# EAGLE design board_io_v2 (EAGLE 6.3)
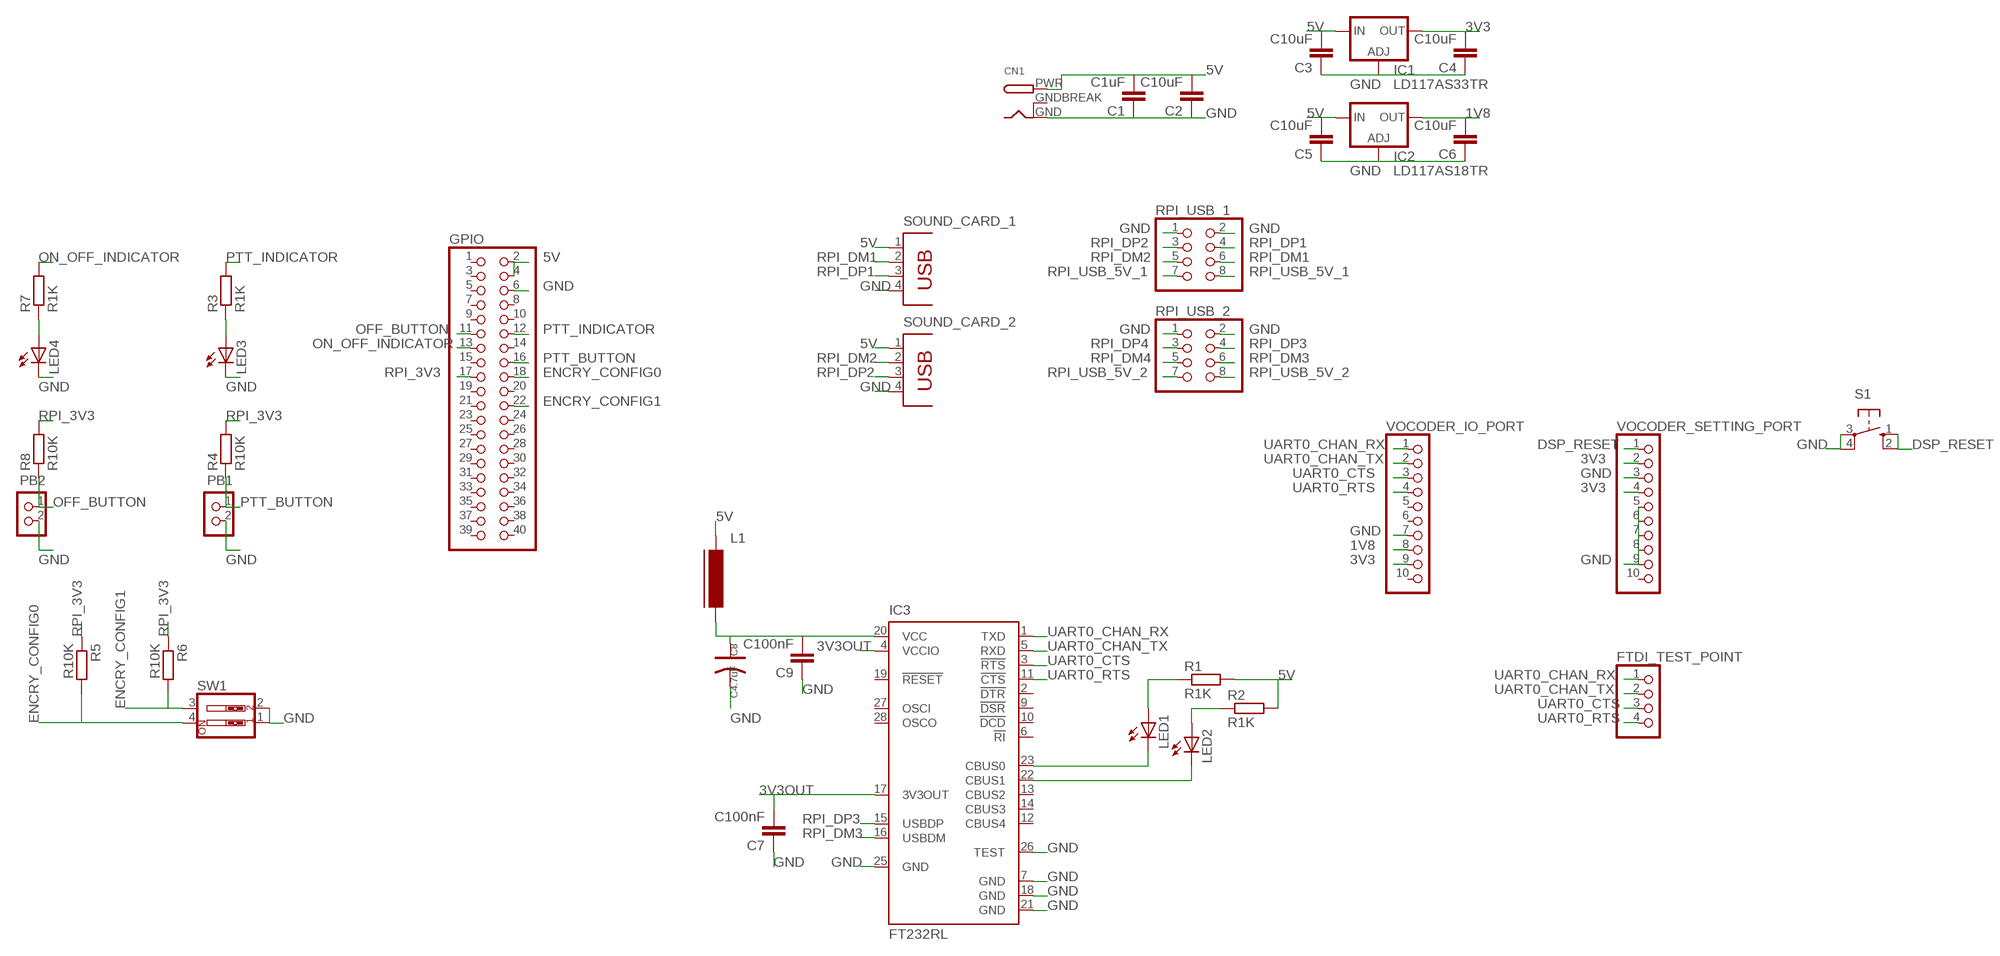
[diagram p0: schematic, sheet 1]

## Parts
C1  C1uF  C-EUC0805  [C0805]
C2  C10uF  C-EUC0805  [C0805]
C3  C10uF  C-EUC0805  [C0805]
C4  C10uF  C-EUC0805  [C0805]
C5  C10uF  C-EUC0805  [C0805]
C6  C10uF  C-EUC0805  [C0805]
C7  C100nF  C-EUC0805  [C0805]
C8  C4.7uF  C-POLAR-C  [AVX-C]
C9  C100nF  C-EUC0805  [C0805]
CN1  DCBARRELPTH  [DCJACK_2MM_PTH]
FTDI_TEST_POINT  PINHD-1X4  [1X04]
GPIO  PINHD-2X20  [2X20]
IC1  LD117AS33TR  [SOT223]
IC2  LD117AS18TR  [SOT223]
IC3  FT232RL  [SSOP28]
L1  FERRITE-0603  [FB603]
LED1  LEDCHIP-LED0805  [CHIP-LED0805]
LED2  LEDCHIP-LED0805  [CHIP-LED0805]
LED3  LEDCHIP-LED0805  [CHIP-LED0805]
LED4  LEDCHIP-LED0805  [CHIP-LED0805]
PB1  CON_HEADER_1X02-PTH  [M1X2]
PB2  CON_HEADER_1X02-PTH  [M1X2]
R1  R1K  R-EU_R0805  [R0805]
R2  R1K  R-EU_R0805  [R0805]
R3  R1K  R-EU_R0805  [R0805]
R4  R10K  R-EU_R0805  [R0805]
R5  R10K  R-EU_R0805  [R0805]
R6  R10K  R-EU_R0805  [R0805]
R7  R1K  R-EU_R0805  [R0805]
R8  R10K  R-EU_R0805  [R0805]
RPI_USB_1  PINHD-2X4  [2X04]
RPI_USB_2  PINHD-2X4  [2X04]
S1  10-XX  [B3F-10XX]
SOUND_CARD_1  PN87520  [PN87520]
SOUND_CARD_2  PN87520  [PN87520]
SW1  SW_DIP-2  [DIPSWITCH-02]
VOCODER_IO_PORT  PINHD-1X10  [1X10]
VOCODER_SETTING_PORT  PINHD-1X10  [1X10]

## Nets
1V8: C6.2 IC2.4(OUT) VOCODER_IO_PORT.8
3V3: C4.2 IC1.4(OUT) VOCODER_IO_PORT.9 VOCODER_SETTING_PORT.2 VOCODER_SETTING_PORT.4
3V3OUT: C7.2 IC3.4(VCCIO) IC3.17(3V3OUT)
5V: C1.2 C2.2 C3.2 C5.2 CN1.PWR GPIO.2 GPIO.4 IC1.3(IN) IC2.3(IN) L1.1 R1.2 R2.2 SOUND_CARD_1.1 SOUND_CARD_2.1
DSP_RESET: S1.1(S) S1.2(S1) VOCODER_SETTING_PORT.1
ENCRY_CONFIG0: GPIO.18 R5.2 SW1.4
ENCRY_CONFIG1: GPIO.22 R6.2 SW1.3
GND: C1.1 C2.1 C3.1 C4.1 C5.1 C6.1 C7.1 C8.- C9.1 CN1.GND GPIO.6 IC1.1(ADJ) IC2.1(ADJ) IC3.7(GND) IC3.18(GND) IC3.21(GND) IC3.25(GND) IC3.26(TEST) LED3.C LED4.C PB1.2 PB2.2 RPI_USB_1.1 RPI_USB_1.2 RPI_USB_2.1 RPI_USB_2.2 S1.3(P) S1.4(P1) SOUND_CARD_1.4 SOUND_CARD_2.4 SW1.1 SW1.2 VOCODER_IO_PORT.7 VOCODER_SETTING_PORT.3 VOCODER_SETTING_PORT.5 VOCODER_SETTING_PORT.6 VOCODER_SETTING_PORT.7 VOCODER_SETTING_PORT.8 VOCODER_SETTING_PORT.9
N$1: C8.+ C9.2 IC3.20(VCC) L1.2
N$2: IC3.22(CBUS1) LED2.C
N$3: IC3.23(CBUS0) LED1.C
N$4: LED2.A R2.1
N$5: LED1.A R1.1
N$6: LED4.A R7.1
N$7: LED3.A R3.1
OFF_BUTTON: GPIO.11 PB2.1 R8.1
ON_OFF_INDICATOR: GPIO.13 R7.2
PTT_BUTTON: GPIO.16 PB1.1 R4.1
PTT_INDICATOR: GPIO.12 R3.2
RPI_3V3: GPIO.17 R4.2 R5.1 R6.1 R8.2
RPI_DM1: RPI_USB_1.6 SOUND_CARD_1.2
RPI_DM2: RPI_USB_1.5 SOUND_CARD_2.2
RPI_DM3: IC3.16(USBDM) RPI_USB_2.6
RPI_DM4: RPI_USB_2.5
RPI_DP1: RPI_USB_1.4 SOUND_CARD_1.3
RPI_DP2: RPI_USB_1.3 SOUND_CARD_2.3
RPI_DP3: IC3.15(USBDP) RPI_USB_2.4
RPI_DP4: RPI_USB_2.3
RPI_USB_5V_1: RPI_USB_1.7 RPI_USB_1.8
RPI_USB_5V_2: RPI_USB_2.7 RPI_USB_2.8
UART0_CHAN_RX: FTDI_TEST_POINT.1 IC3.1(TXD) VOCODER_IO_PORT.1
UART0_CHAN_TX: FTDI_TEST_POINT.2 IC3.5(RXD) VOCODER_IO_PORT.2
UART0_CTS: FTDI_TEST_POINT.3 IC3.3(!RTS) VOCODER_IO_PORT.3
UART0_RTS: FTDI_TEST_POINT.4 IC3.11(!CTS) VOCODER_IO_PORT.4
Unconnected: GPIO.1 GPIO.3 GPIO.5 GPIO.7 GPIO.8 GPIO.9 GPIO.10 GPIO.14 GPIO.15 GPIO.19 GPIO.20 GPIO.21 GPIO.23 GPIO.24 GPIO.25 GPIO.26 GPIO.27 GPIO.28 GPIO.29 GPIO.30 GPIO.31 GPIO.32 GPIO.33 GPIO.34 GPIO.35 GPIO.36 GPIO.37 GPIO.38 GPIO.39 GPIO.40 IC3.2(!DTR) IC3.6(!RI) IC3.9(!DSR) IC3.10(!DCD) IC3.12(CBUS4) IC3.13(CBUS2) IC3.14(CBUS3) IC3.19(!RESET) IC3.27(OSCI) IC3.28(OSCO) VOCODER_IO_PORT.5 VOCODER_IO_PORT.6 VOCODER_IO_PORT.10 VOCODER_SETTING_PORT.10

## Power pins joined to a net without a drawn wire
GNDBREAK: CN1.GNDBREAK

## Library data of the parts
C1-C7 C9 = resistor:C-EU: CAPACITOR, European symbol
C8 = OPL Eagle Library:C-POLAR*
CN1 = adafruit:DCBARREL: 2.0mm DC Barrel Jack DCJACK_2MM_PTH - Through Hole Jack (4UConnector: 05537)
FTDI_TEST_POINT = pinhead:PINHD-1X4: PIN HEADER
GPIO = pinhead:PINHD-2X20: PIN HEADER
IC1 IC2 = v-reg:LD117A?*: Low drop fixed and adjustable positive voltage regulators 1 A Source: http://www.st.com/stonline/products/literature/ds/7194/ld1117axx.pdf
IC3 = ftdichip:FT232R: Source: http://www.ftdichip.com/Documents/DataSheets/DS_FT232R_v104.pdf; MPN: FT232RL; OC_FARNELL: 1146032; OC_NEWARK: 91K9918
L1 = dp_devices:FERRITE: Ferrite bead in various packages
LED1-LED4 = led:LED: LED OSRAM: - CHIPLED LG R971, LG N971, LY N971, LG Q971, LY Q971, LO R971, LY R971 LH N974, LH R974 LS Q976, LO Q976, LY Q976 LO Q996 - Hyper CHIPLED LW Q18S LB Q993, LB Q99A, LB R99A - SideLED LS A670, LO A670, LY A670, LG A670, LP A670 LB A673, LV A673, LT A673, LW A673 LH A674 LY A675 LS A676, LA A676, LO A676, LY A676, LW A676 LS A679, LY A679, LG A679 - Hyper Micro SIDELED® LS Y876, LA Y876, LO Y876, LY Y876 LT Y87S - SmartLED LW L88C, LW L88S LB L89C, LB L89S, LG L890 LS L89K, LO L89K, LY L89K LS L896, LA L896, LO L896, LY L896 - TOPLED LS T670, LO T670, LY T670, LG T670, LP T670 LSG T670, LSP T670, LSY T670, LOP T670, LYG T670 LG T671, LOG T671, LSG T671 LB T673, LV T673, LT T673, LW T673 LH T674 LS T676, LA T676, LO T676, LY T676, LB T676, LH T676, LSB T676, LW T676 LB T67C, LV T67C, LT T67C, LS T67K, LO T67K, LY T67K, LW E67C LS E67B, LA E67B, LO E67B, LY E67B, LB E67C, LV E67C, LT E67C LW T67C LS T679, LY T679, LG T679 LS T770, LO T770, LY T770, LG T770, LP T770 LB T773, LV T773, LT T773, LW T773 LH T774 LS E675, LA E675, LY E675, LS T675 LS T776, LA T776, LO T776, LY T776, LB T776 LHGB T686 LT T68C, LB T68C - Hyper Mini TOPLED® LB M676 - Mini TOPLED Santana® LG M470 LS M47K, LO M47K, LY M47K Source: http://www.osram.convergy.de LUXEON: - LUMILED® LXK2-PW12-R00, LXK2-PW12-S00, LXK2-PW14-U00, LXK2-PW14-V00 LXK2-PM12-R00, LXK2-PM12-S00, LXK2-PM14-U00 LXK2-PE12-Q00, LXK2-PE12-R00, LXK2-PE12-S00, LXK2-PE14-T00, LXK2-PE14-U00 LXK2-PB12-K00, LXK2-PB12-L00, LXK2-PB12-M00, LXK2-PB14-N00, LXK2-PB14-P00, LXK2-PB14-Q00 LXK2-PR12-L00, LXK2-PR12-M00, LXK2-PR14-Q00, LXK2-PR14-R00 LXK2-PD12-Q00, LXK2-PD12-R00, LXK2-PD12-S00 LXK2-PH12-R00, LXK2-PH12-S00 LXK2-PL12-P00, LXK2-PL12-Q00, LXK2-PL12-R00 Source: www.luxeon.com KINGBRIGHT: KA-3528ASYC Source: www.kingbright.com
PB1 PB2 = dp_devices:CON_HEADER_1X02
R1-R8 = resistor:R-EU_: RESISTOR, European symbol
RPI_USB_1 RPI_USB_2 = pinhead:PINHD-2X4: PIN HEADER
S1 = switch-omron:10-XX: OMRON SWITCH; MPN: B3F-1000; OC_FARNELL: 176432; OC_NEWARK: 36M3542
SOUND_CARD_1 SOUND_CARD_2 = con-berg:PN87520: BERG USB connector; OC_FARNELL: unknown; OC_NEWARK: unknown
SW1 = SparkFun-Electromechanical:SW_DIP-2: DIP SWITCH
VOCODER_IO_PORT VOCODER_SETTING_PORT = pinhead:PINHD-1X10: PIN HEADER

## Board
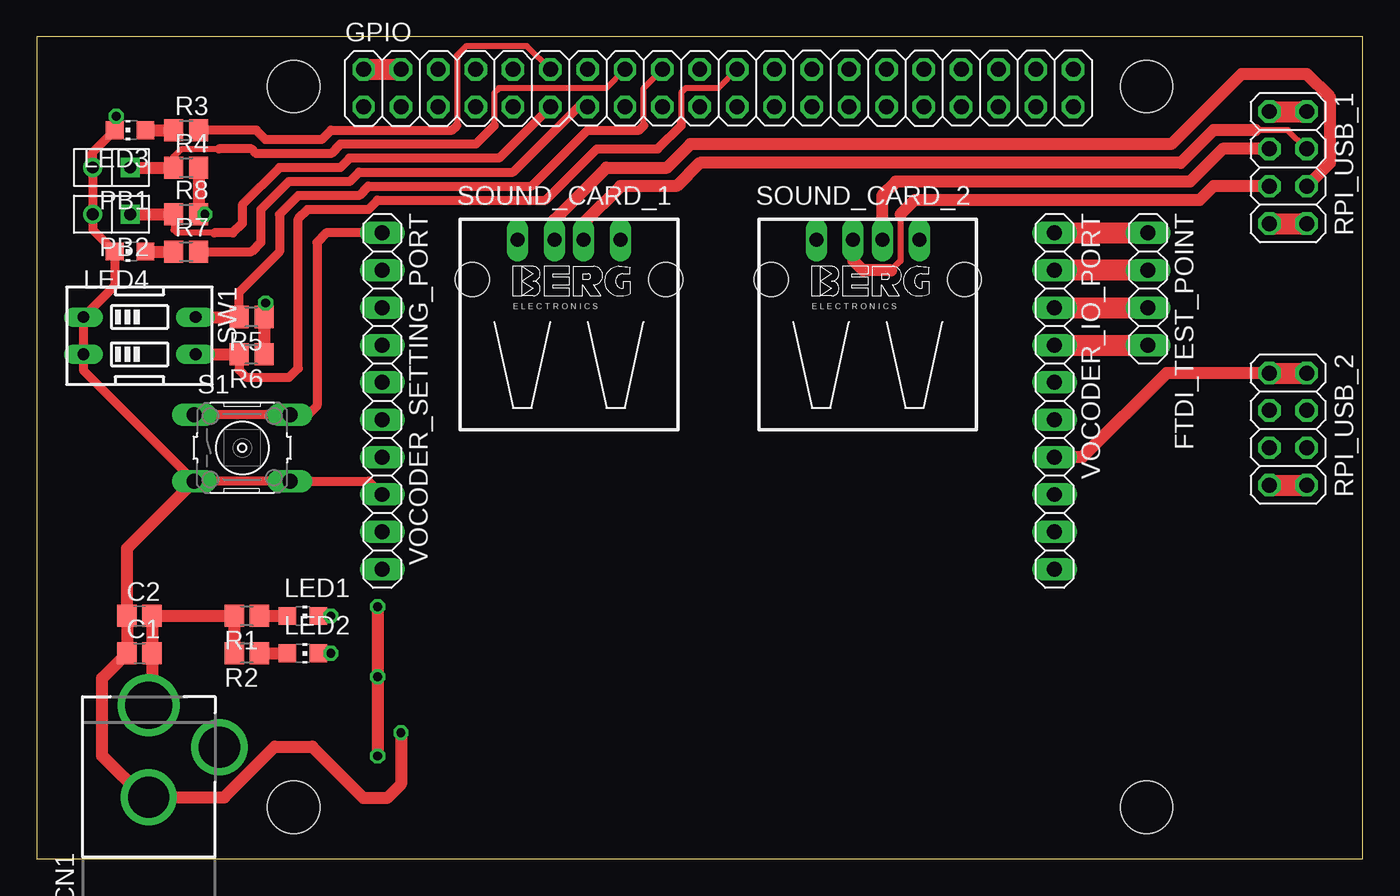
[diagram p1: board, top side]
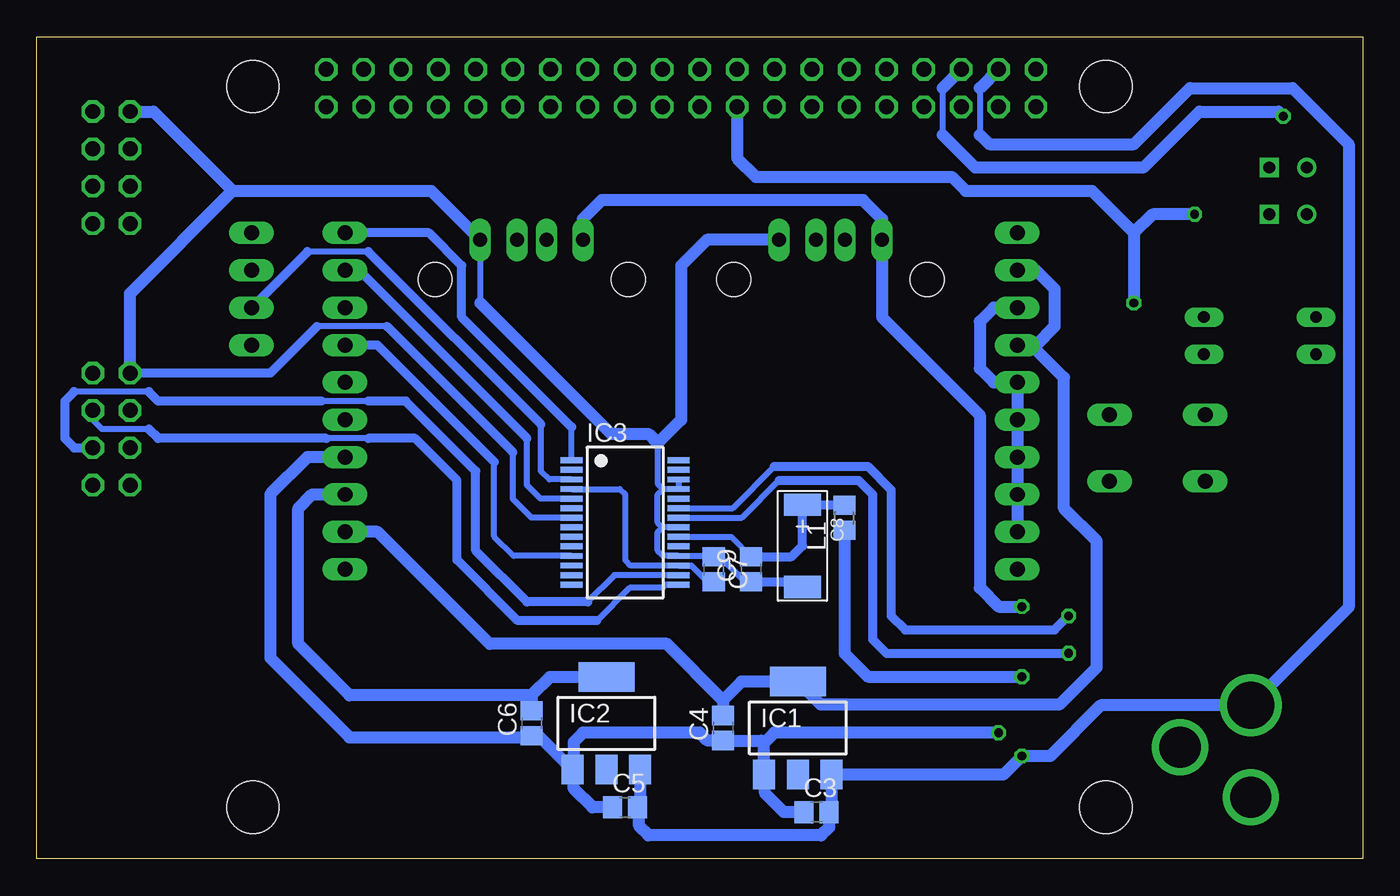
[diagram p2: board, bottom side, seen from below]

Size 90.17 x 55.88 mm. Coordinates in mm from the lower left corner, seen from the top.
Outline: 0,0 90.17,0 90.17,55.88 0,55.88 0,0
Copper layers (1*16): Top 0.035mm / dielectric 1.5mm / Bottom 0.035mm
Design rules "default": minimum track width 10mil, minimum drill 24mil, track to track 8mil, track to pad 8mil, pad to pad 8mil, via to via 8mil, smd to smd 8mil, copper to edge 40mil, drill to drill 8mil, minimum pad ring 10mil, minimum via ring 8mil, stop-mask expansion 4mil, vias tented up to drill 0mil, thermal gap 10mil
Holes 3.55 mm at 17.47,3.5 75.47,3.5 17.47,52.5 75.47,52.5
tRestrict: area 15.9,1.9 to 19,5; area 73.9,1.9 to 77,5; area 15.9,51 to 19,54; area 73.9,51 to 77,54
bRestrict: area 15.9,1.9 to 19,5; area 73.9,1.9 to 77,5; area 73.9,51 to 77,54; area 15.9,51 to 19,54

### Footprints (pad centres in the part's own frame; a part is rotated, then mirrored left to right if it is on the bottom)
C0805 = smd 1.3 x 1.5: 1 -0.85,0; 2 0.85,0
AVX-C = smd 1.524 x 2.54: + -2.794,0; - 2.794,0
DCJACK_2MM_PTH = drill 2.8: GND 0,7.35; GNDBREAK 4.8,10.75 | drill 3.2: PWR 0,13.6
1X04 = drill 1.016 long: 1 -3.81,0; 2 -1.27,0; 3 1.27,0; 4 3.81,0
2X20 = drill 1.016 octagon: 1 -24.13,-1.27; 2 -24.13,1.27; 3 -21.59,-1.27; 4 -21.59,1.27; 5 -19.05,-1.27; 6 -19.05,1.27; 7 -16.51,-1.27; 8 -16.51,1.27; 9 -13.97,-1.27; 10 -13.97,1.27; 11 -11.43,-1.27; 12 -11.43,1.27; 13 -8.89,-1.27; 14 -8.89,1.27; 15 -6.35,-1.27; 16 -6.35,1.27; 17 -3.81,-1.27; 18 -3.81,1.27; 19 -1.27,-1.27; 20 -1.27,1.27; 21 1.27,-1.27; 22 1.27,1.27; 23 3.81,-1.27; 24 3.81,1.27; 25 6.35,-1.27; 26 6.35,1.27; 27 8.89,-1.27; 28 8.89,1.27; 29 11.43,-1.27; 30 11.43,1.27; 31 13.97,-1.27; 32 13.97,1.27; 33 16.51,-1.27; 34 16.51,1.27; 35 19.05,-1.27; 36 19.05,1.27; 37 21.59,-1.27; 38 21.59,1.27; 39 24.13,-1.27; 40 24.13,1.27
SOT223 = smd 1.5 x 2: 1 -2.3,-3.15; 2 0,-3.15; 3 2.3,-3.15 | smd 3.8 x 2: 4 0,3.15
SSOP28 = smd 0.4 x 1.5: 1 -4.225,-3.625; 2 -3.575,-3.625; 3 -2.925,-3.625; 4 -2.275,-3.625; 5 -1.625,-3.625; 6 -0.975,-3.625; 7 -0.325,-3.625; 8 0.325,-3.625; 9 0.975,-3.625; 10 1.625,-3.625; 11 2.275,-3.625; 12 2.925,-3.625; 13 3.575,-3.625; 14 4.225,-3.625; 15 4.225,3.625; 16 3.575,3.625; 17 2.925,3.625; 18 2.275,3.625; 19 1.625,3.625; 20 0.975,3.625; 21 0.325,3.625; 22 -0.325,3.625; 23 -0.975,3.625; 24 -1.625,3.625; 25 -2.275,3.625; 26 -2.925,3.625; 27 -3.575,3.625; 28 -4.225,3.625
FB603 = smd 1.3 x 1.5: 1 -0.85,0; 2 0.85,0
CHIP-LED0805 = smd 1.2 x 1.2: A 0,-1.05; C 0,1.05
M1X2 = drill 0.8 square: 1 -1.27,0 | drill 0.8: 2 1.27,0
R0805 = smd 1.3 x 1.5: 1 -0.85,0; 2 0.85,0
2X04 = drill 1.016 octagon: 1 -3.81,-1.27; 2 -3.81,1.27; 3 -1.27,-1.27; 4 -1.27,1.27; 5 1.27,-1.27; 6 1.27,1.27; 7 3.81,-1.27; 8 3.81,1.27
B3F-10XX = drill 1.016 long: 1 -3.251,2.261; 2 3.251,2.261; 3 -3.251,-2.261; 4 3.251,-2.261
PN87520 = drill 0.95 long: 1 -3.5,2.71; 2 -1,2.71; 3 1,2.71; 4 3.5,2.71 | hole 2.3: -6.57,0; 6.57,0
DIPSWITCH-02 = drill 0.813 long: 1 -1.27,-3.81; 2 1.27,-3.81; 3 1.27,3.81; 4 -1.27,3.81
1X10 = drill 1.016 long: 1 -11.43,0; 2 -8.89,0; 3 -6.35,0; 4 -3.81,0; 5 -1.27,0; 6 1.27,0; 7 3.81,0; 8 6.35,0; 9 8.89,0; 10 11.43,0

### Placement (x,y rotation side)
C1  6.99,13.97 0 top
C2  6.99,16.51 0 top
C3  37.15,3.17 0 bottom
C4  43.5,8.89 90 bottom
C5  50.16,3.49 0 bottom
C6  56.52,9.21 90 bottom
C7  44.13,19.68 270 bottom
C8  38.1,21.27 270 bottom
C9  41.59,19.68 90 bottom
CN1  7.62,-3.17 0 top
FTDI_TEST_POINT  75.56,38.73 270 top
GPIO  46.35,52.39 0 top
IC1  38.42,8.89 0 bottom
IC2  51.44,9.21 0 bottom
IC3  50.16,22.86 270 bottom
L1  35.24,23.18 90 bottom
LED1  18.1,16.51 270 top
LED2  18.1,13.97 270 top
LED3  6.35,49.53 90 top
LED4  6.35,41.27 90 top
PB1  5.08,46.99 180 top
PB2  5.08,43.81 180 top
R1  14.29,16.51 180 top
R2  14.29,13.97 180 top
R3  10.16,49.53 0 top
R4  10.16,46.99 0 top
R5  14.61,36.83 180 top
R6  14.61,34.29 180 top
R7  10.16,41.27 0 top
R8  10.16,43.81 0 top
RPI_USB_1  85.09,46.99 270 top
RPI_USB_2  85.09,29.21 270 top
S1  13.97,27.94 0 top
SOUND_CARD_1  36.2,39.37 0 top
SOUND_CARD_2  56.52,39.37 0 top
SW1  6.99,35.56 270 top
VOCODER_IO_PORT  69.22,31.11 270 top
VOCODER_SETTING_PORT  23.5,31.11 270 top

### Tracks (layer width: path | path; a pad name or v marks a point on that pad's centre or on a via)
1V8
  Bottom 0.813: IC2.4 55.27,12.36 56.52,11.11 | 56.52,11.11 C6.2 | 56.52,11.11 68.9,11.11 72.39,14.61 72.39,23.81 71.44,24.77 VOCODER_IO_PORT.8
3V3
  Bottom 0.813: 43.5,10.79 42.25,12.04 IC1.4 36.86,10.48 20.64,10.48 18.1,13.02 18.1,21.59 20.32,23.81 20.32,32.7 22.54,34.92 | 43.5,10.79 C4.2 | 43.5,10.79 47.31,14.61 59.37,14.61 66.99,22.23 VOCODER_IO_PORT.9 | VOCODER_SETTING_PORT.2 22.23,40.01 20.96,38.73 20.96,36.2 22.23,34.92 22.54,34.92 | 22.54,34.92 VOCODER_SETTING_PORT.4
3V3OUT
  Bottom 0.406: C7.2 44.35,19.05 44.77,19.05 45.65,19.93 IC3.17 49.78,19.93 50.16,20.32 50.16,24.77 50.53,25.14 IC3.4
5V  (via drill 0.6)
  Top 0.813: R2.2 R1.2 C2.2 C1.2 7.84,10.64 CN1.PWR | v23.18,17.14 v23.18,12.38 v23.18,6.99
  Top 1.422: GPIO.2 GPIO.4
  Bottom 0.406: 26.04,52.39 26.04,49.21
  Bottom 0.813: IC2.3 49.13,3.67 C5.2 49.21,3.39 49.21,2.22 48.58,1.59 36.83,1.59 36.3,2.12 C3.2 36.12,3.35 IC1.3 25.69,5.74 25.67,5.71 24.45,5.71 v23.18,6.99 21.27,6.99 17.83,10.43 CN1.PWR 0.95,17.09 0.95,48.58 4.76,52.39 11.75,52.39 15.56,48.58 25.4,48.58 26.04,49.21 | SOUND_CARD_2.1 53.02,43.5 51.75,44.77 33.97,44.77 32.7,43.49 SOUND_CARD_1.1 32.7,36.82 26.04,30.16 26.04,18.41 24.77,17.14 v23.18,17.14 | GPIO.4 26.04,52.39 | L1.1 35.24,13.97 33.66,12.38 v23.18,12.38
DSP_RESET
  Top 0.61: VOCODER_SETTING_PORT.1 19.69,42.55 19.05,41.91 19.05,30.8 18.41,30.16 17.26,30.16 S1.2 S1.1
ENCRY_CONFIG0
  Top 0.406: GPIO.18 41.27,52.39 41.27,49.85
  Top 0.61: 41.27,49.85 40.96,49.53 37.47,49.53 33.66,45.72 22.54,45.72 21.91,45.09 17.78,45.09 16.51,43.81 16.51,41.27 13.76,38.52 R5.2 13.97,37.05
  Top 0.813: SW1.4 R5.2
ENCRY_CONFIG1
  Top 0.406: GPIO.22 46.35,52.39 44.13,52.39 43.81,52.07 43.81,50.16 | 13.65,34.39 R6.2
  Top 0.61: 43.81,50.16 43.81,49.85 42.23,48.26 38.1,48.26 34.61,44.77 23.18,44.77 22.54,44.13 18.41,44.13 17.78,43.5 17.78,33.34 17.14,32.7 14.29,32.7 13.76,33.23 R6.2
  Top 0.813: SW1.3 R6.2
GND  (via drill 0.6)
  Top 0.61: LED3.C 3.81,48.04 PB1.2 PB2.2 3.81,42.77 LED4.C 5.3,38.95 SW1.1 SW1.2 3.18,33.22 S1.3 S1.4 22.58,25.68 VOCODER_SETTING_PORT.8
  Top 0.813: RPI_USB_2.1 76.84,33.02 71.12,27.3 VOCODER_IO_PORT.7 | v5.4,50.48 5.4,49.63 LED3.C | S1.3 6.14,21.1 C2.1 C1.1 4.45,12.28 4.45,6.99 7.26,4.17 CN1.GND 12.75,4.17 16.19,7.62 18.73,7.62 22.23,4.13 23.81,4.13 24.77,5.08 v24.77,8.57
  Top 1.422: RPI_USB_1.1 RPI_USB_1.2 | RPI_USB_2.1 RPI_USB_2.2
  Bottom 0.406: IC3.7 56.52,23.18 57.78,24.45 57.78,27.62 | IC3.26 IC3.25 47.57,25.14 | 47.57,25.14 47.94,24.77 47.94,22.86 47.62,22.54 | IC3.21 47.62,22.54 | 47.62,22.54 47.94,22.21 47.94,20.95 47.57,20.59 IC3.18 44.18,20.59 C7.1 43.71,20.54 42.23,19.05 41.81,19.05 C9.1 | 66.36,36.2 71.12,36.2 | SOUND_CARD_2.4 60.02,37.79 60.01,37.78 | 47.94,28.26 47.94,25.5 47.57,25.14 | 28.58,52.39 28.58,49.21
  Bottom 0.61: 57.78,27.62 66.36,36.2 | C9.1 38.46,18.84 C8.- | 71.12,36.2 74.3,33.02 RPI_USB_2.1
  Bottom 0.813: C5.1 52.39,3.49 53.66,4.76 53.66,5.98 IC2.1 | IC2.1 56.03,8.36 C6.1 56.62,8.26 68.9,8.26 74.3,13.65 74.3,24.77 71.75,27.3 VOCODER_IO_PORT.7 | C3.1 39.37,3.17 40.64,4.45 40.64,5.66 IC1.1 40.72,7.86 | IC2.1 53.66,6.13 53.66,7.94 53.02,8.57 45.09,8.57 44.55,8.04 C4.1 40.9,8.04 40.72,7.86 | VOCODER_SETTING_PORT.9 VOCODER_SETTING_PORT.8 VOCODER_SETTING_PORT.7 VOCODER_SETTING_PORT.6 VOCODER_SETTING_PORT.5 25.08,32.38 26.04,33.34 26.04,36.51 25.08,37.47 VOCODER_SETTING_PORT.3 | 60.01,37.78 51.12,28.89 48.58,28.89 47.94,28.26 46.35,29.84 46.35,40.32 44.6,42.08 SOUND_CARD_1.4 | SOUND_CARD_2.4 63.34,45.4 76.84,45.4 | RPI_USB_1.1 82.23,50.8 76.84,45.4 | RPI_USB_2.1 83.82,38.42 76.84,45.4 | GPIO.6 28.58,52.39 | 28.58,49.21 26.35,46.99 14.92,46.99 11.11,50.8 5.71,50.8 v5.4,50.48 | 40.72,7.86 40.01,8.57 v24.77,8.57
N$1
  Bottom 0.406: IC3.20 42.94,21.89 C9.2
  Bottom 0.61: C9.2 38.84,20.54 38.1,21.27 C8.+ 35.28,24.07 L1.2
N$2  (via drill 0.6)
  Top 0.61: v20,13.97 LED2.C
  Bottom 0.406: IC3.22 42.22,23.18 39.69,25.72
  Bottom 0.61: 39.69,25.72 34.29,25.72 33.34,24.77 33.34,14.92 32.38,13.97 v20,13.97
N$3  (via drill 0.6)
  Top 0.61: v20,16.51 LED1.C
  Bottom 0.406: IC3.23 42.84,23.84 40.01,26.67
  Bottom 0.61: 40.01,26.67 33.66,26.67 32.07,25.08 32.07,16.51 31.12,15.56 20.96,15.56 v20,16.51
N$4
  Top 0.813: R2.1 LED2.A
N$5
  Top 0.813: R1.1 LED1.A
N$6
  Top 0.813: LED4.A R7.1
N$7
  Top 0.813: LED3.A R3.1
OFF_BUTTON
  Top 0.406: 12.07,42.55 9.53,42.55 9.31,42.76 R8.1
  Top 0.61: GPIO.11 31.43,47.62 21.27,47.62 20.64,46.99 16.51,46.99 13.97,44.45 13.97,43.18 13.34,42.55 12.07,42.55
  Top 0.813: PB2.1 R8.1
ON_OFF_INDICATOR
  Top 0.61: GPIO.13 36.83,51.12 32.38,46.67 21.91,46.67 21.27,46.04 17.14,46.04 15.24,44.13 15.24,41.91 14.61,41.27 R7.2
PTT_BUTTON
  Top 0.406: GPIO.16 38.73,52.39 31.43,52.39 31.12,52.07 31.12,49.85 | R4.1 9.31,47.73 9.84,48.26 12.38,48.26
  Top 0.61: 31.12,49.85 29.84,48.58 20.64,48.58 20,47.94 14.92,47.94 14.61,48.26 12.38,48.26
  Top 0.813: PB1.1 R4.1
PTT_INDICATOR
  Top 0.406: GPIO.12 33.34,55.24 29.21,55.24 28.58,54.61 28.58,49.85
  Top 0.61: 28.58,49.85 28.26,49.53 20,49.53 19.37,48.9 15.56,48.9 14.92,49.53 R3.2
RPI_3V3  (via drill 0.6)
  Top 0.813: R4.2 R8.2 v11.43,43.81 | R6.1 R5.1 15.56,36.93 v15.56,37.78
  Bottom 0.813: v11.43,43.81 14.29,43.81 15.56,42.55 | 15.56,42.55 v15.56,37.78 | GPIO.17 42.55,47.62 41.27,46.35 27.94,46.35 26.99,45.4 18.41,45.4 15.56,42.55
RPI_DM1
  Top 0.813: RPI_USB_1.6 87.95,47.31 87.95,51.75 86.36,53.34 81.91,53.34 77.15,48.58 44.45,48.58 42.86,46.99 38.73,46.99 35.2,43.45 SOUND_CARD_1.2
RPI_DM2
  Top 0.406: 58.74,43.81 58.74,40.64 58.1,40.01
  Top 0.813: RPI_USB_1.5 80.01,45.72 79.06,44.77 59.69,44.77 58.74,43.81 | 58.1,40.01 56.2,40.01 55.52,40.69 SOUND_CARD_2.2
RPI_DM3
  Bottom 0.406: IC3.16 50.88,19.29 52.7,17.46 | 67.63,31.11 70.8,31.11 | 82.55,31.75 87.63,31.75
  Bottom 0.61: 52.7,17.46 56.83,17.46 60.32,20.95 60.32,26.35 65.09,31.11 67.63,31.11 | 82.55,31.75 81.91,31.11 70.8,31.11 | 87.63,31.75 88.27,31.11 88.27,28.57 87.63,27.94 RPI_USB_2.6
RPI_DP1
  Top 0.406: RPI_USB_1.4 85.09,49.53 82.87,49.53
  Top 0.813: 82.87,49.53 80.01,49.53 77.79,47.31 45.09,47.31 43.5,45.72 39.69,45.72 37.2,43.23 SOUND_CARD_1.3
RPI_DP2
  Top 0.813: RPI_USB_1.3 80.64,48.26 78.42,46.04 58.42,46.04 57.52,45.13 SOUND_CARD_2.3
RPI_DP3
  Bottom 0.406: IC3.15 47.41,18.64 47.62,18.41 49.85,18.41 52.07,16.19 | 67.63,28.57 70.48,28.57 | 82.55,29.21 85.72,29.21 86.36,29.84 RPI_USB_2.4
  Bottom 0.61: 52.07,16.19 57.47,16.19 61.59,20.32 61.59,25.72 64.45,28.57 67.63,28.57 | 70.48,28.57 81.91,28.57 82.55,29.21
RPI_USB_5V_1
  Top 1.422: RPI_USB_1.7 RPI_USB_1.8
RPI_USB_5V_2
  Top 1.422: RPI_USB_2.7 RPI_USB_2.8
UART0_CHAN_RX
  Top 1.422: VOCODER_IO_PORT.1 FTDI_TEST_POINT.1
  Bottom 0.406: IC3.1 53.79,29.34
  Bottom 0.61: 53.79,29.34 61.28,36.83 61.28,40.32 63.5,42.55 VOCODER_IO_PORT.1
UART0_CHAN_TX
  Top 1.422: FTDI_TEST_POINT.2 VOCODER_IO_PORT.2
  Bottom 0.406: IC3.5 55.92,24.48 56.83,25.4 56.83,28.57
  Bottom 0.61: 56.83,28.57 68.26,40.01 VOCODER_IO_PORT.2
UART0_CTS
  Top 1.422: VOCODER_IO_PORT.3 FTDI_TEST_POINT.3
  Bottom 0.406: 67.63,41.27 71.75,41.27 | 55.88,29.53 55.88,26.35 55.31,25.79 IC3.3
  Bottom 0.61: 71.75,41.27 FTDI_TEST_POINT.3 | 55.88,29.53 67.63,41.27
UART0_RTS
  Top 1.422: VOCODER_IO_PORT.4 FTDI_TEST_POINT.4
  Bottom 0.406: IC3.11 57.73,20.59 59.05,21.91 59.05,26.99
  Bottom 0.61: VOCODER_IO_PORT.4 66.99,34.92 59.05,26.99